# EasyEDA schematic Vector Body Board Schematic.json

## Sheets
1 Power Supply: TITLE: Power Supplies; REV: 1.0; Date: 2021-02-27; Sheet: 1/1; Company: Vector Body Board
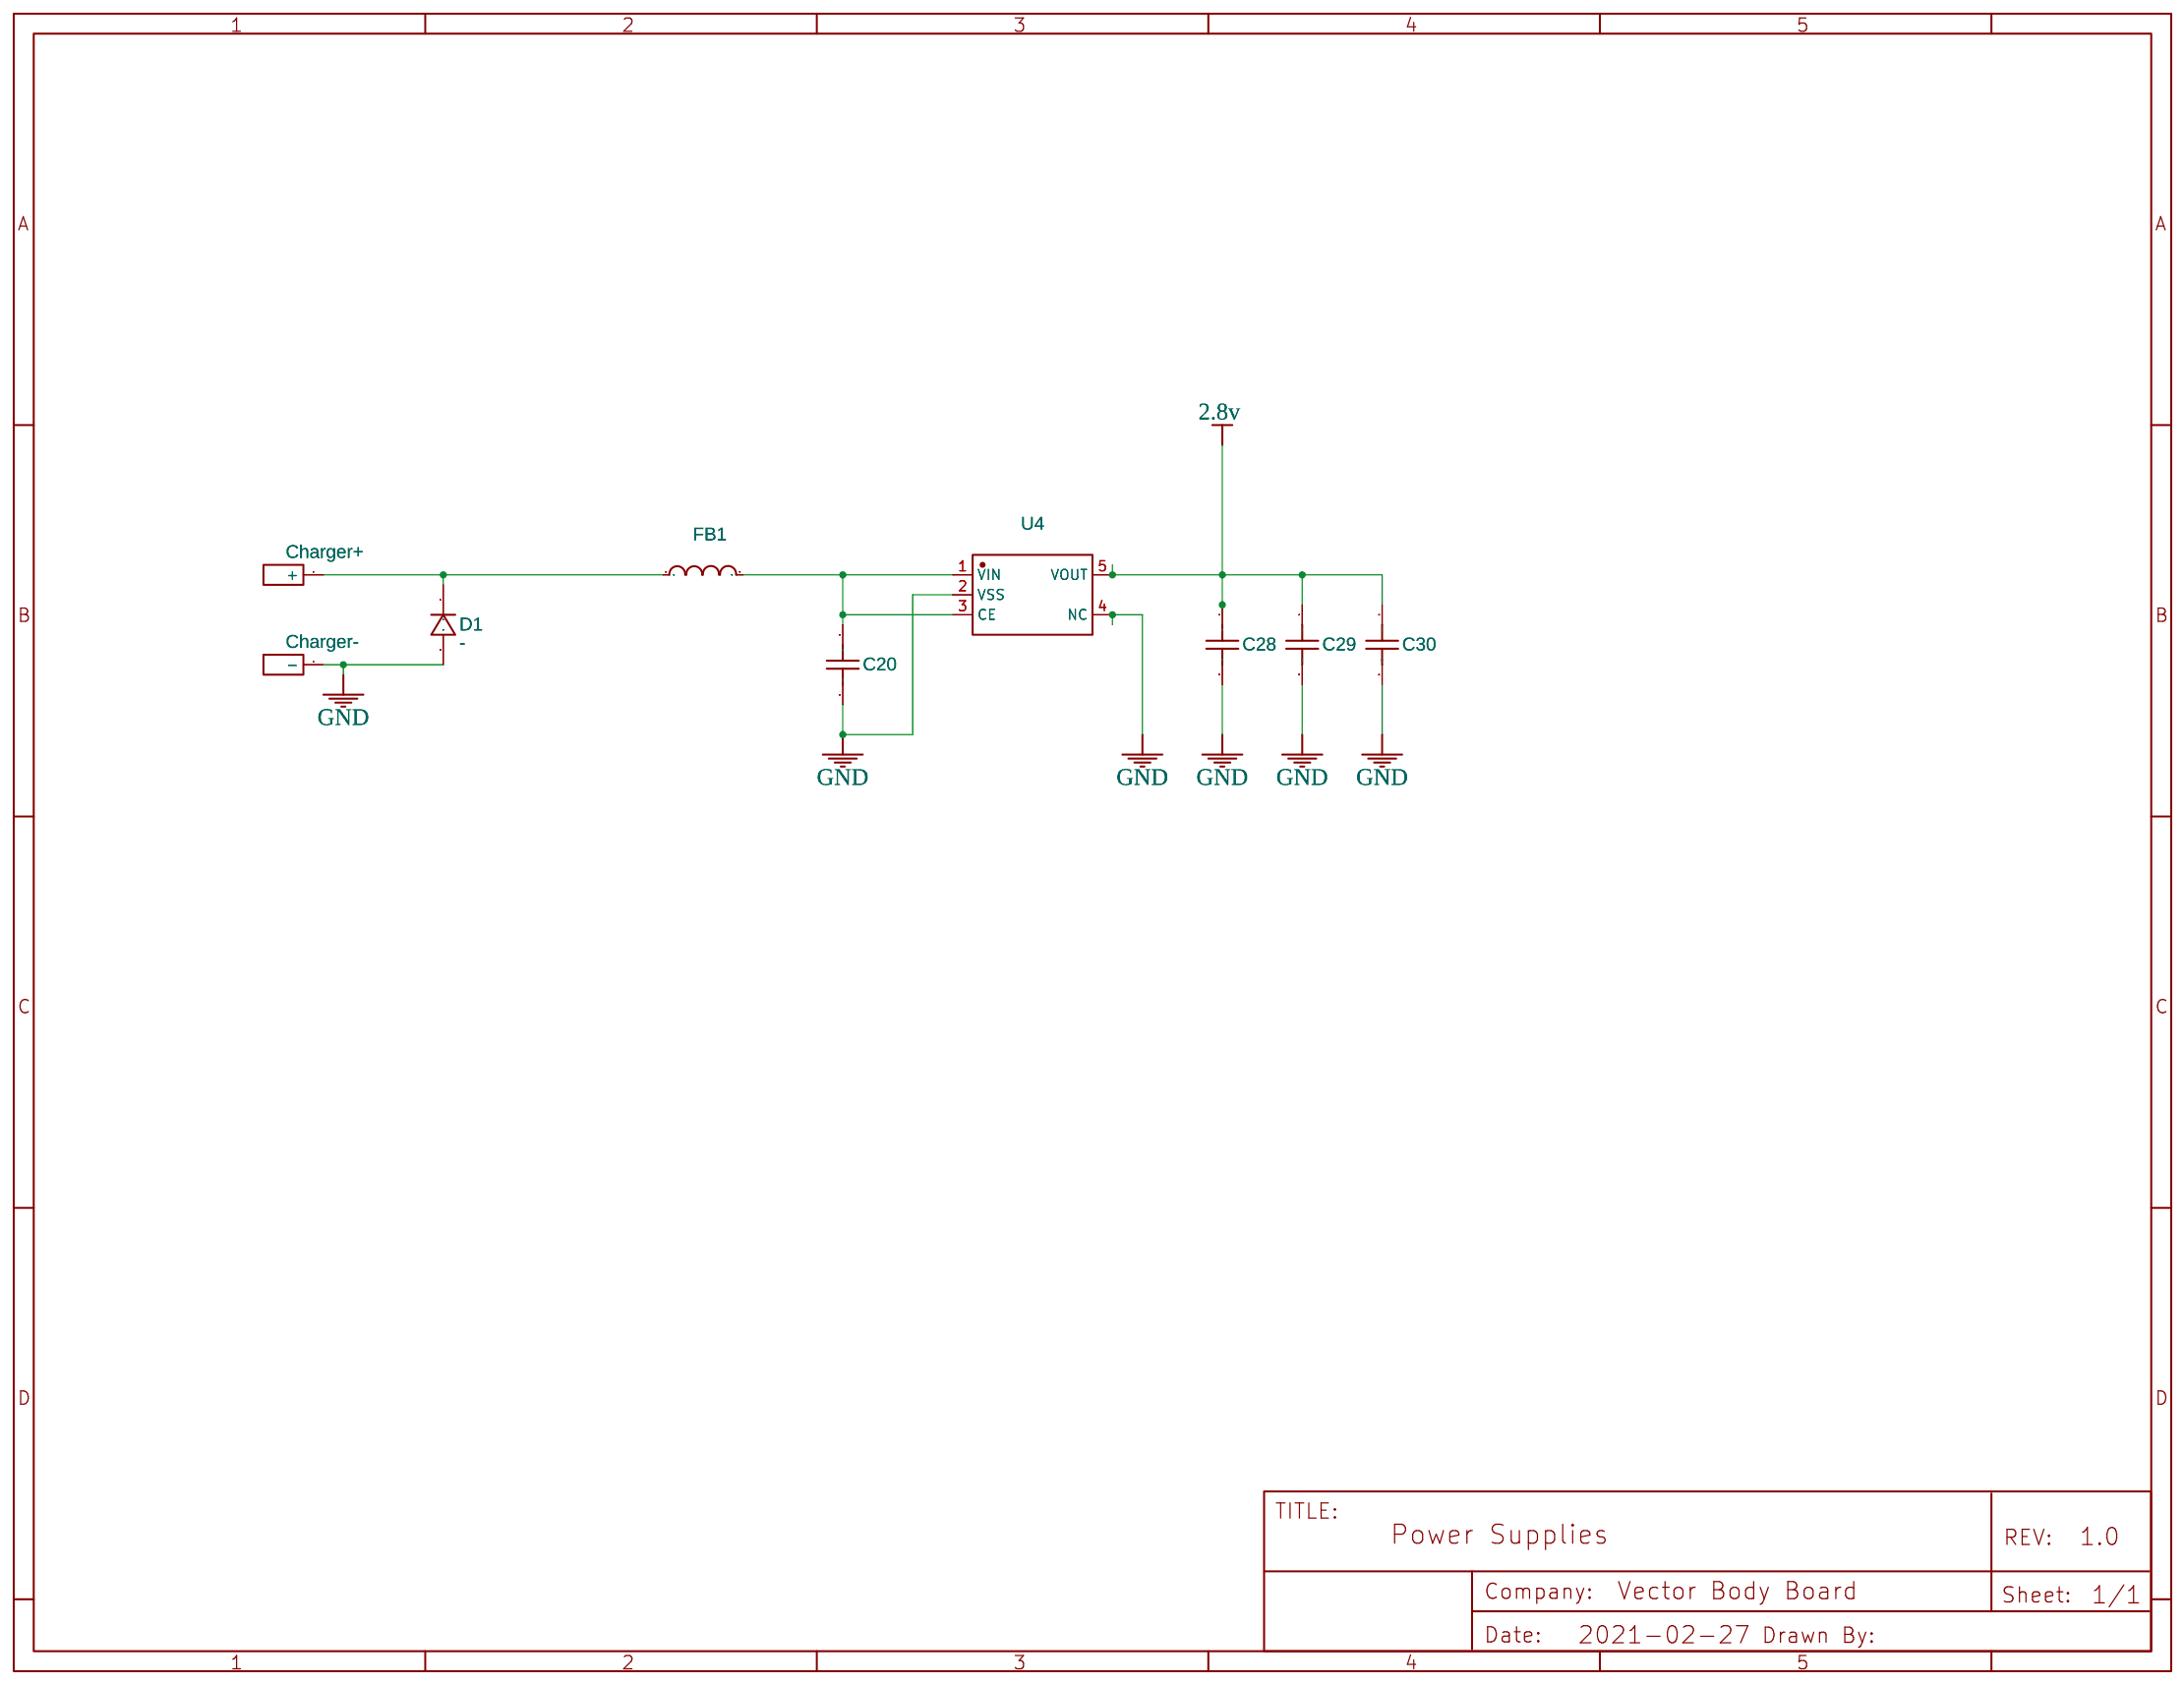
[diagram p0: Power Supply]
2 Sensing: TITLE: Sensing
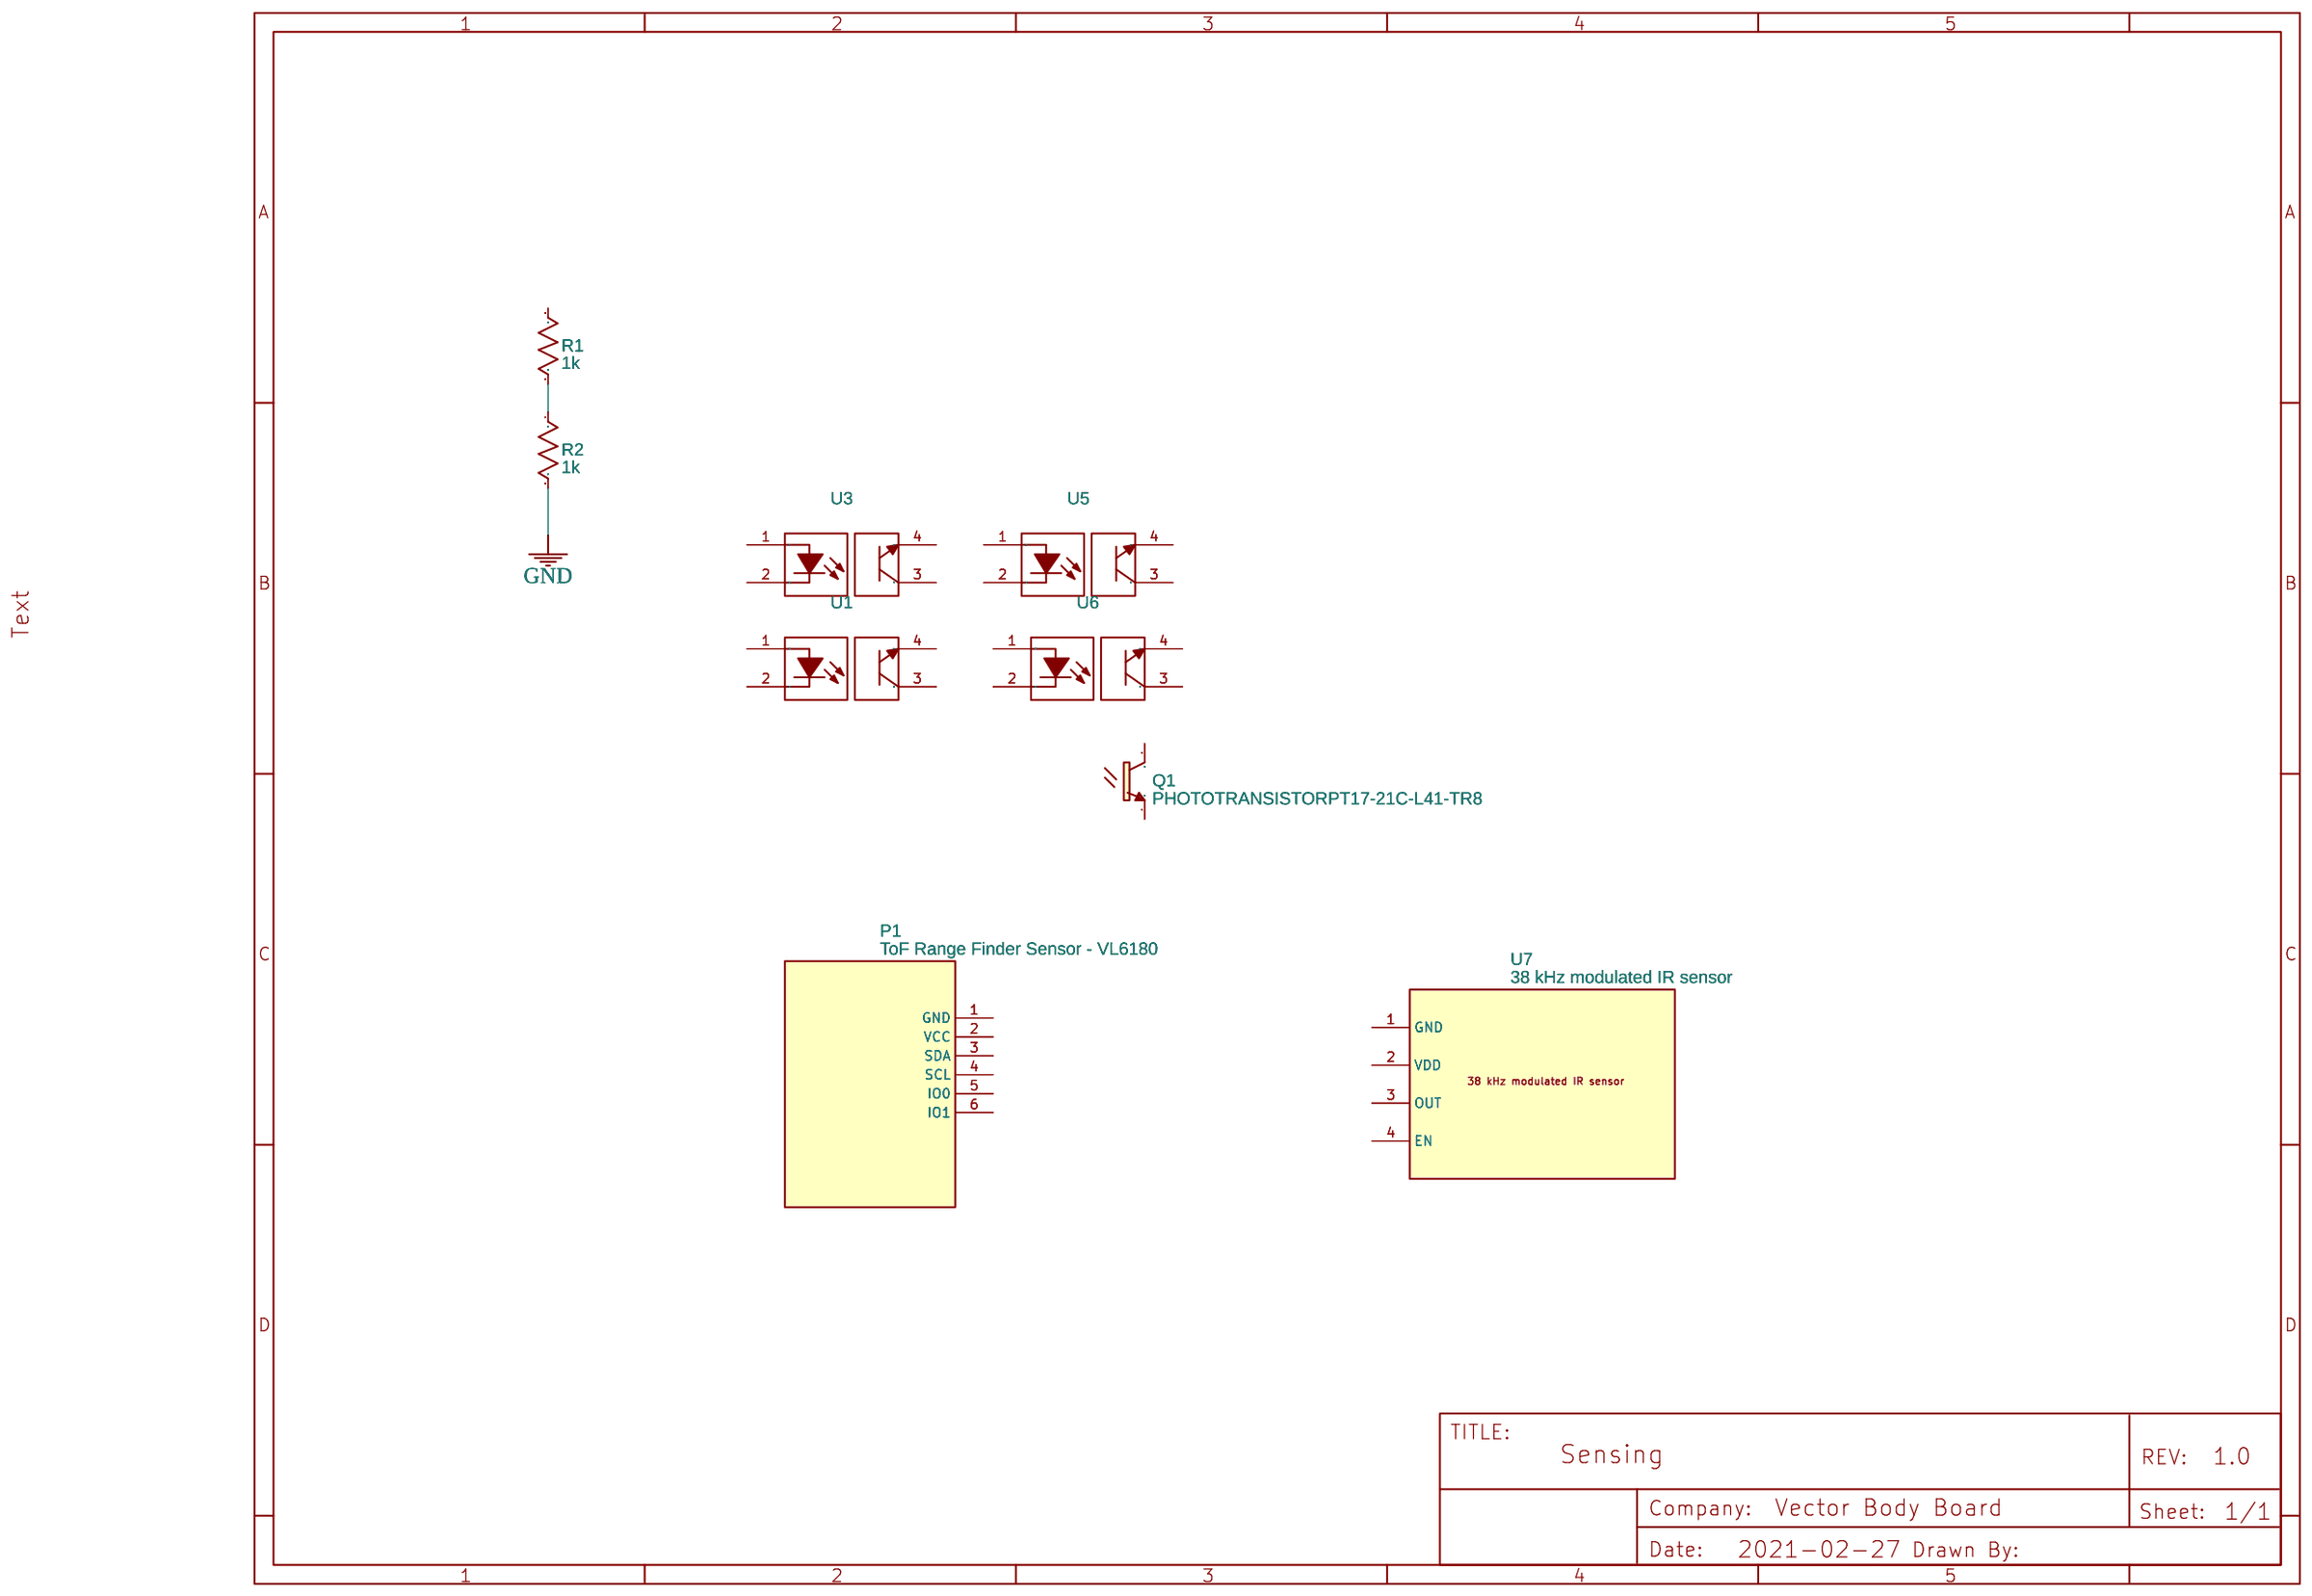
[diagram p1: Sensing]
3 Microcontroller: TITLE: Microcontroller
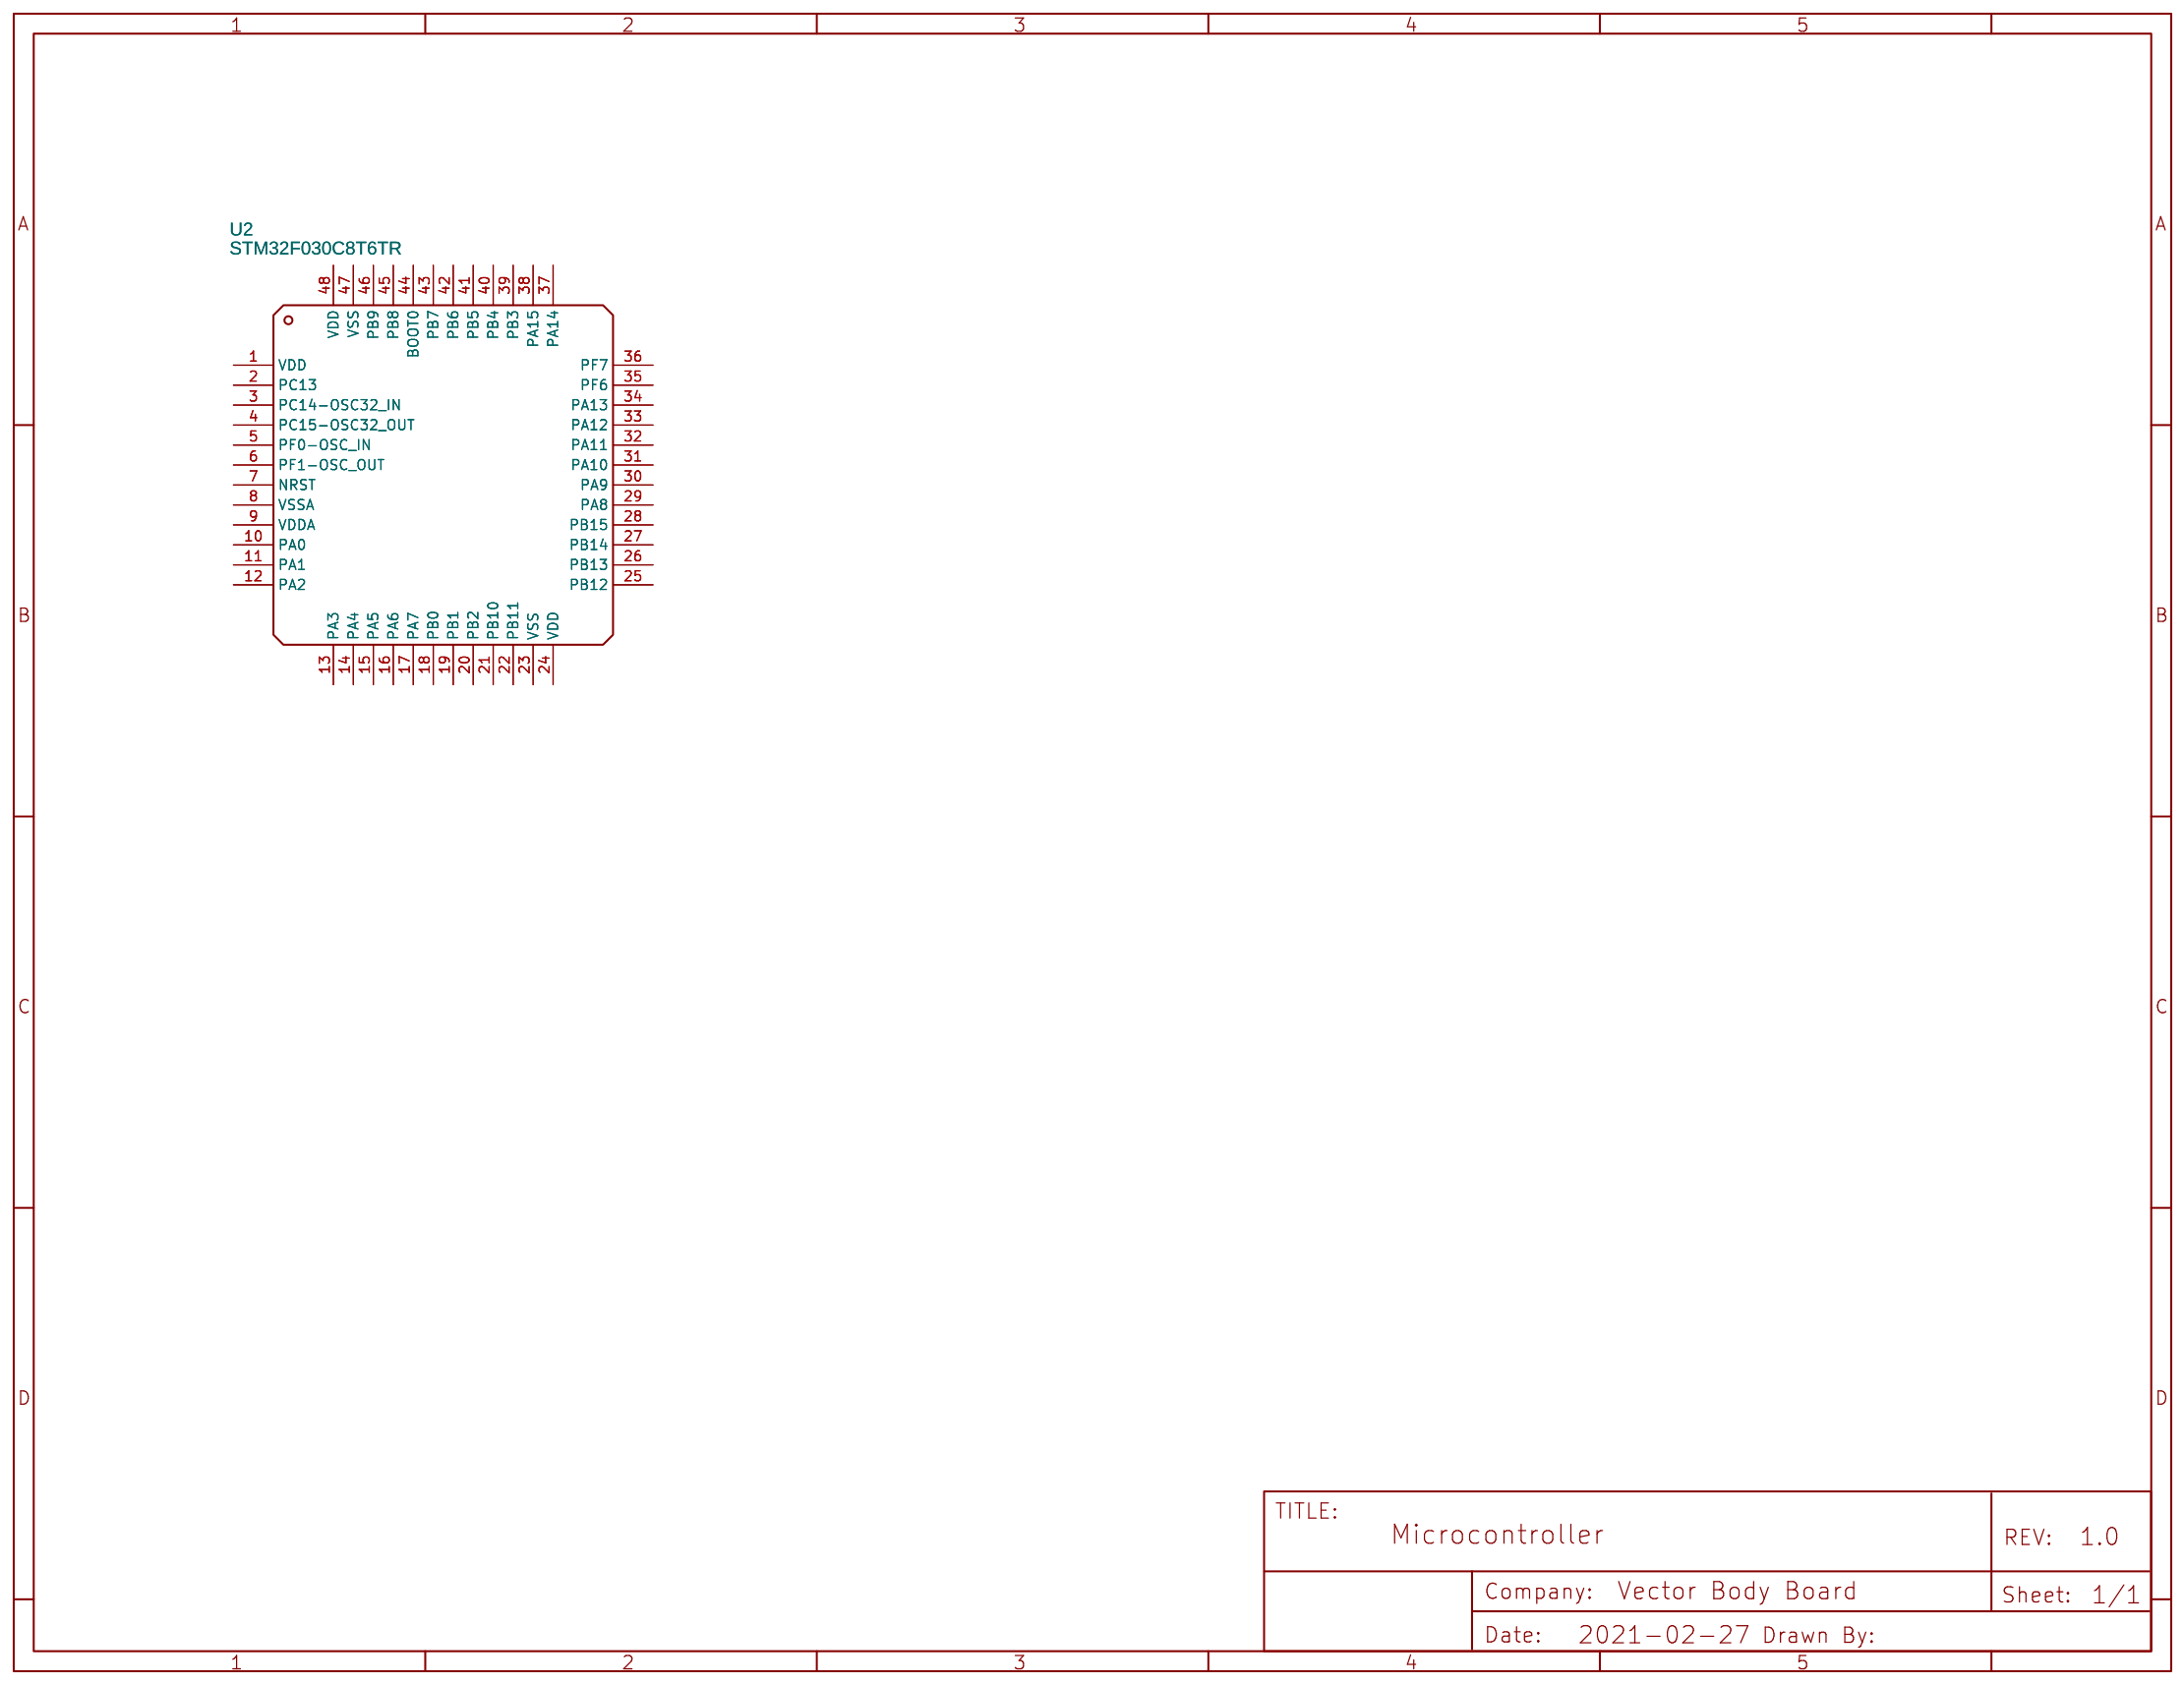
[diagram p2: Microcontroller]

## Parts
sheet Microcontroller
U2  STM32F030C8T6TR  [LQFP-48_L7.0-W7.0-P0.50-LS9.0-TL]
sheet Power Supply
+  Charger+  [HDR-M-2.54_1X1]
C20  1u  [C0603]
C28  0.1u  [C0603]
C29  0.1u  [C0603]
C30  0.1u  [C0603]
D1  -  [SOD-123_L2.8-W1.8-LS3.7-RD]
FB1  Straight-through  [BEAD-TH_BD3.5-L6.0-P10.00-D0.9]
J2  Charger-  [HDR-M-2.54_1X1]
U4  XC6204B282MR  [SOT-25_L3.0-W1.6-P0.95-LS2.8-BR]
sheet Sensing
P1  ToF Range Finder Sensor - VL6180  [TOF RANGE FINDER SENSOR - VL6180]
Q1  PHOTOTRANSISTORPT17-21C-L41-TR8  [PT17-21C-L41-TR8]
R1  1k  [R0603]
R2  1k  [R0603]
U1  H21A1  [OPTO-TH_H21A2]
U3  H21A1  [OPTO-TH_H21A2]
U5  H21A1  [OPTO-TH_H21A2]
U6  H21A1  [OPTO-TH_H21A2]
U7  38 kHz modulated IR sensor  [38 KHZ MODULATED IR SENSOR]

## Library data of the parts
U2 = STM32F030C8T6TR: Supplier: LCSC; Manufacturer: STMicroelectronics; image: //image.lceda.cn/szlcsc/C40053.jpg; Supplier Part: C40053; SMT Type: Extend; JLCPCB SMD: Yes; LCSC Assembly: Yes; Assembly Type: smtWeld; Paste Type: expand
+ = HDR-M-2.54_1x1: Supplier Part: C81276; Supplier: LCSC; Contributor: LCEDA_Lib
C20 C28-C30 = C_0603_US: Contributor: LCEDA_Lib
D1 = 1N4007W: Supplier: LCSC; Supplier Part: C328592; Manufacturer: BLUE ROCKET; Contributor: LCEDA_Lib
FB1 = Straight-through beads: Supplier: LCSC; Manufacturer: ML; Supplier Part: C46030; LCSC Assembly: Yes; SMT Type: Extend; Assembly Type: manualWeld; Paste Type: expand
J2 = HDR-M-2.54_1x1: Supplier: LCSC; Contributor: LCEDA_Lib
U4 = XC6204B282MR: Supplier: LCSC; Supplier Part: C17012; Manufacturer: Torex Semicon; Contributor: LCSC; SMT Type: Extend; JLCPCB SMD: Yes; LCSC Assembly: Yes; Assembly Type: smtWeld; Paste Type: expand
P1 = ToF Range Finder Sensor - VL6180: sourceId: bLWUga4Kg; Supplier Part: 12587; Supplier: SparkFun
Q1 = PHOTOTRANSISTORPT17-21C-L41-TR8: Contributor: SparkFun
R1 R2 = R_0603_US: Contributor: LCEDA_Lib
U1 U3 U5 U6 = H21A1: Supplier: LCSC; Manufacturer: ISOCOM; Supplier Part: C90607; LCSC Assembly: Yes; SMT Type: Extend; Assembly Type: manualWeld; Paste Type: expand
U7 = 38 kHz modulated IR sensor: Contributor: winter2015; sourceId: YsmgyP7pj

## Nets
2.8v: C28.1 C29.1 C30.1 U4.5(VOUT)
GND: C20.2 C28.2 C29.2 C30.2 D1.2 J2.1(-) R2.2 U4.2(VSS) U4.4(NC)
Net-(+-1): +.1(+) D1.1 FB1.1
Net-(C20-1): C20.1 FB1.2 U4.1(VIN) U4.3(CE)
Net-(R1-2): R1.2 R2.1

Not connected (* = marked no-connect by the designer): P1 1(GND) 2(VCC) 3(SDA) 4(SCL) 5(IO0) 6(IO1); Q1 C E; R1 1; U1 1 2 3 4; U2 1(VDD) 2(PC13) 3(PC14-OSC32_IN) 4(PC15-OSC32_OUT) 5(PF0-OSC_IN) 6(PF1-OSC_OUT) 7(NRST) 8(VSSA) 9(VDDA) 10(PA0) 11(PA1) 12(PA2) 13(PA3) 14(PA4) 15(PA5) 16(PA6) 17(PA7) 18(PB0) 19(PB1) 20(PB2) 21(PB10) 22(PB11) 23(VSS) 24(VDD) 25(PB12) 26(PB13) 27(PB14) 28(PB15) 29(PA8) 30(PA9) 31(PA10) 32(PA11) 33(PA12) 34(PA13) 35(PF6) 36(PF7) 37(PA14) 38(PA15) 39(PB3) 40(PB4) 41(PB5) 42(PB6) 43(PB7) 44(BOOT0) 45(PB8) 46(PB9) 47(VSS) 48(VDD); U3 1 2 3 4; U5 1 2 3 4; U6 1 2 3 4; U7 1(GND) 2(VDD) 3(OUT) 4(EN)
